# Altium schematic sheet KaBnd Block Dia A.SchDoc: Interconnect
size B; Date: 1/1/17; CompanyName: National Center for Atmospheric Research; DrawnBy: Rich Erickson; Engineer: 4/21/17; Organization: Earth Observing Laboratory; Address1: 3450 Mitchell Lane; Address2: FL1; Address3: 3090 Center Green Dr.; Address4: Boulder, CO. 80301; DocumentNumber: Block Diagram; Revision: A; SheetNumber: 1; SheetTotal: 1; Department: Remote Sensing Facility; PageSetup: Record=PageOptions|CenterHorizontal=True|CenterVertical=True|PrintScale=0.70|XCorrection=1.00|YCorrection=1.00|PrintKind=1|BorderSize=5000000|LeftOffset=0|BottomOffset=0|Orientation=2|PaperLength=1000|PaperWidth=1000|Scale=100|PaperSource=273|PrintQuality=600|MediaType=1|DitherType=10|PrintScaleMode=1|PaperKind=Letter|PaperIndex=1; ModifiedDate: 7/17/97; ImagePath: 4/21/17; ProjectName: Ka Band; Application_BuildNumber: 5
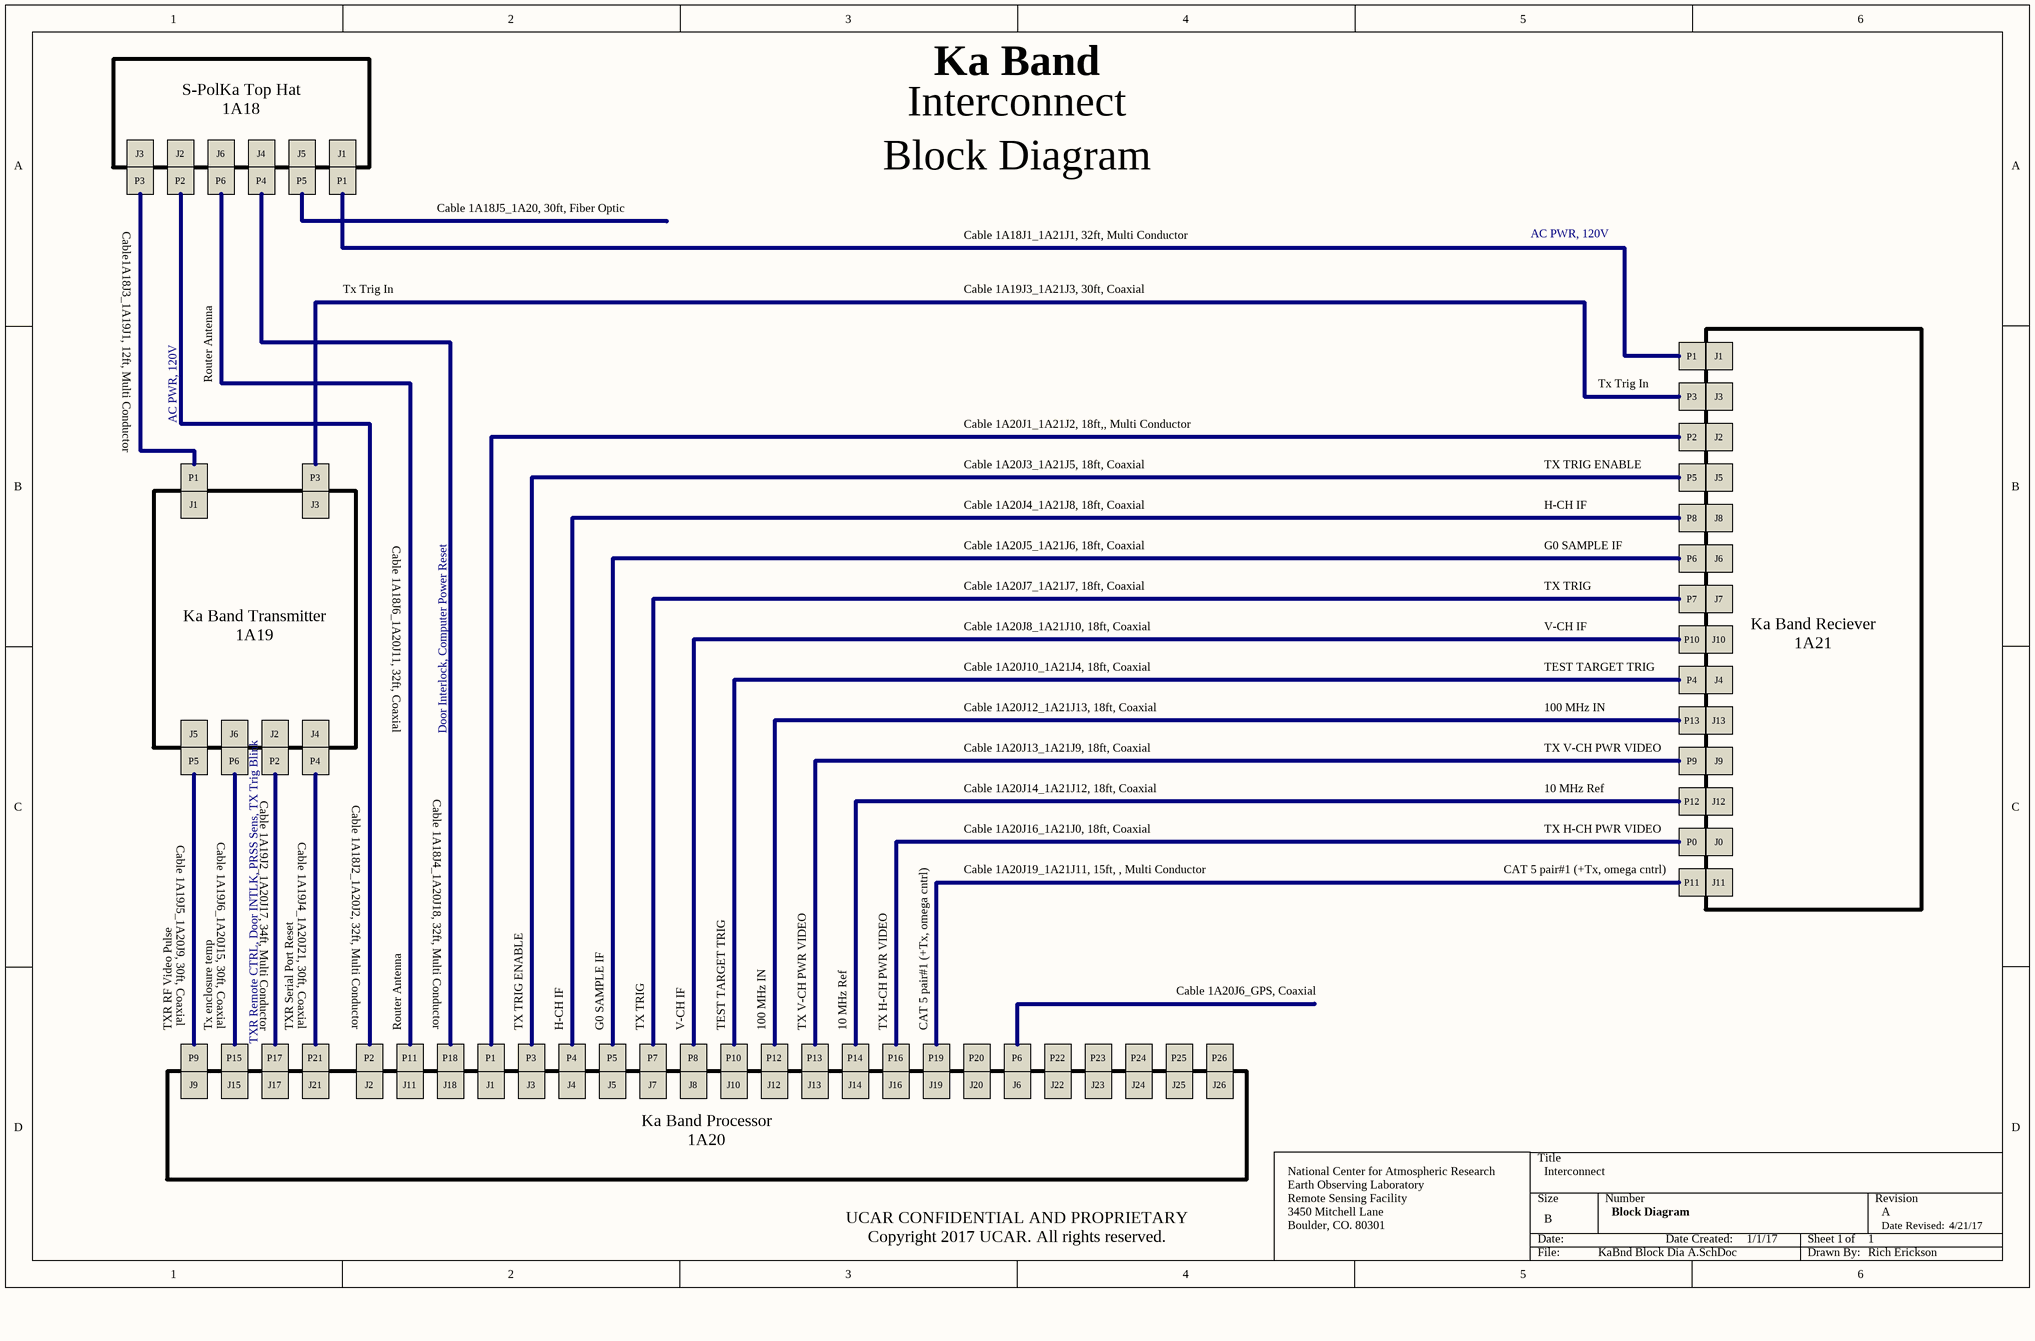
[diagram p0: KaBnd Block Dia A.SchDoc]

## Notes on the sheet
- S-PolKa Top Hat
  1A18
- J3
- J2
- J6
- J4
- J5
- J1
- P3
- P2
- P6
- P4
- P5
- P1
- Cable 1A18J5_1A20, 30ft, Fiber Optic
- Cable 1A18J1_1A21J1, 32ft, Multi Conductor
- AC PWR, 120V
- Tx Trig In
- Cable 1A19J3_1A21J3, 30ft, Coaxial
- Cable1A18J3_1A19J1, 12ft, Multi Conductor
- Router Antenna
- Cable 1A20J1_1A21J2, 18ft,, Multi Conductor
- Cable 1A20J3_1A21J5, 18ft, Coaxial
- Cable 1A20J4_1A21J8, 18ft, Coaxial
- TX TRIG ENABLE
- H-CH IF
- Cable 1A20J5_1A21J6, 18ft, Coaxial
- G0 SAMPLE IF
- P8
- J8
- Cable 1A20J7_1A21J7, 18ft, Coaxial
- Cable 1A20J8_1A21J10, 18ft, Coaxial
- TX TRIG
- V-CH IF
- P7
- P10
- J7
- J10
- Cable 1A20J10_1A21J4, 18ft, Coaxial
- Cable 1A20J12_1A21J13, 18ft, Coaxial
- TEST TARGET TRIG
- 100 MHz IN
- Ka Band Transmitter
  1A19
- Cable 1A18J6_1A20J11, 32ft, Coaxial
- Door Interlock, Computer Power Reset
- Cable 1A20J13_1A21J9, 18ft, Coaxial
- TX V-CH PWR VIDEO
- P9
- P13
- J9
- J13
- Cable 1A20J14_1A21J12, 18ft, Coaxial
- Cable 1A20J16_1A21J0, 18ft, Coaxial
- 10 MHz Ref
- TX H-CH PWR VIDEO
- P0
- P12
- J0
- J12
- Cable 1A19J2_1A20J17, 34ft, Multi Conductor
- Cable 1A20J19_1A21J11, 15ft, , Multi Conductor
- CAT 5 pair#1 (+Tx, omega cntrl)
- P11
- Ka Band Reciever
  1A21
- J11
- Cable 1A19J5_1A20J9, 30ft, Coaxial
- Cable 1A19J6_1A20J15, 30ft, Coaxial
- Cable 1A19J4_1A20J21, 30ft, Coaxial
- TXR RF Video Pulse
- Tx enclosure temp
- TXR Remote CTRL, Door INTLK, PRSS Sens, TX Trig Blink
- TXR Serial Port Reset
- Cable 1A18J2_1A20J2, 32ft, Multi Conductor
- Cable 1A18J4_1A20J18, 32ft, Multi Conductor
- Cable 1A20J6_GPS, Coaxial
- P15
- J15
- P17
- J17
- P21
- J21
- P18
- J18
- P14
- J14
- P16
- J16
- P19
- J19
- P20
- J20
- P22
- J22
- P23
- J23
- P24
- J24
- P25
- J25
- P26
- J26
- Ka Band Processor
  1A20
- UCAR CONFIDENTIAL AND PROPRIETARY
  Copyright 2017 UCAR. All rights reserved.
- Date Created:
- Date Revised: